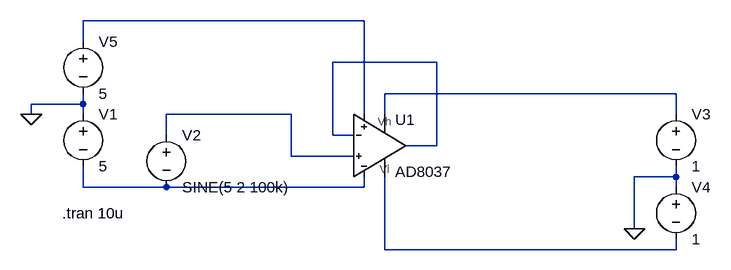
[diagram p0: schematic ad8037-test-circuit.asc]
ad8037-test-circuit.asc, the LTspice schematic file:
Version 4
SHEET 1 880 680
WIRE 208 -48 -224 -48
WIRE -224 -16 -224 -48
WIRE 320 16 160 16
WIRE 688 64 240 64
WIRE -224 80 -224 64
WIRE -224 80 -304 80
WIRE -304 96 -304 80
WIRE -224 96 -224 80
WIRE 96 96 -96 96
WIRE 208 96 208 -48
WIRE 240 96 240 64
WIRE 688 96 688 64
WIRE -96 128 -96 96
WIRE 160 128 160 16
WIRE 192 128 160 128
WIRE 320 144 320 16
WIRE 320 144 272 144
WIRE 96 160 96 96
WIRE 192 160 96 160
WIRE 688 192 688 176
WIRE 688 192 624 192
WIRE -224 208 -224 176
WIRE -96 208 -224 208
WIRE 208 208 208 192
WIRE 208 208 -96 208
WIRE 688 208 688 192
WIRE 624 272 624 192
WIRE 240 304 240 192
WIRE 688 304 688 288
WIRE 688 304 240 304
FLAG 624 272 0
FLAG -304 96 0
SYMBOL AD8037 224 144 R0
SYMATTR InstName U1
SYMBOL voltage -224 80 R0
WINDOW 123 0 0 Left 0
WINDOW 39 24 124 Left 2
SYMATTR InstName V1
SYMATTR Value 5
SYMBOL voltage -96 112 R0
WINDOW 123 0 0 Left 0
WINDOW 39 0 0 Left 0
SYMATTR InstName V2
SYMATTR Value SINE(5 2 100k)
SYMBOL voltage 688 80 R0
WINDOW 123 0 0 Left 0
WINDOW 39 0 0 Left 0
SYMATTR InstName V3
SYMATTR Value 1
SYMBOL voltage 688 192 R0
WINDOW 123 0 0 Left 0
WINDOW 39 0 0 Left 0
SYMATTR InstName V4
SYMATTR Value 1
SYMBOL voltage -224 -32 R0
WINDOW 123 0 0 Left 0
WINDOW 39 0 0 Left 0
SYMATTR InstName V5
SYMATTR Value 5
TEXT -256 248 Left 2 !.tran 10u

The netlist it stands for:
* ad8037-test-circuit.asc
XU1 N004 N002 N001 N005 N002 N003 N006 AD8037  ; pins In+ In- V+ V- OUT Vh Vl
V1 0 N005 5
V2 N004 N005 SINE(5 2 100k)
V3 N003 0 1
V4 0 N006 1
V5 N001 0 5
.tran 10u
.lib Ad8037.lib
.backanno
.end